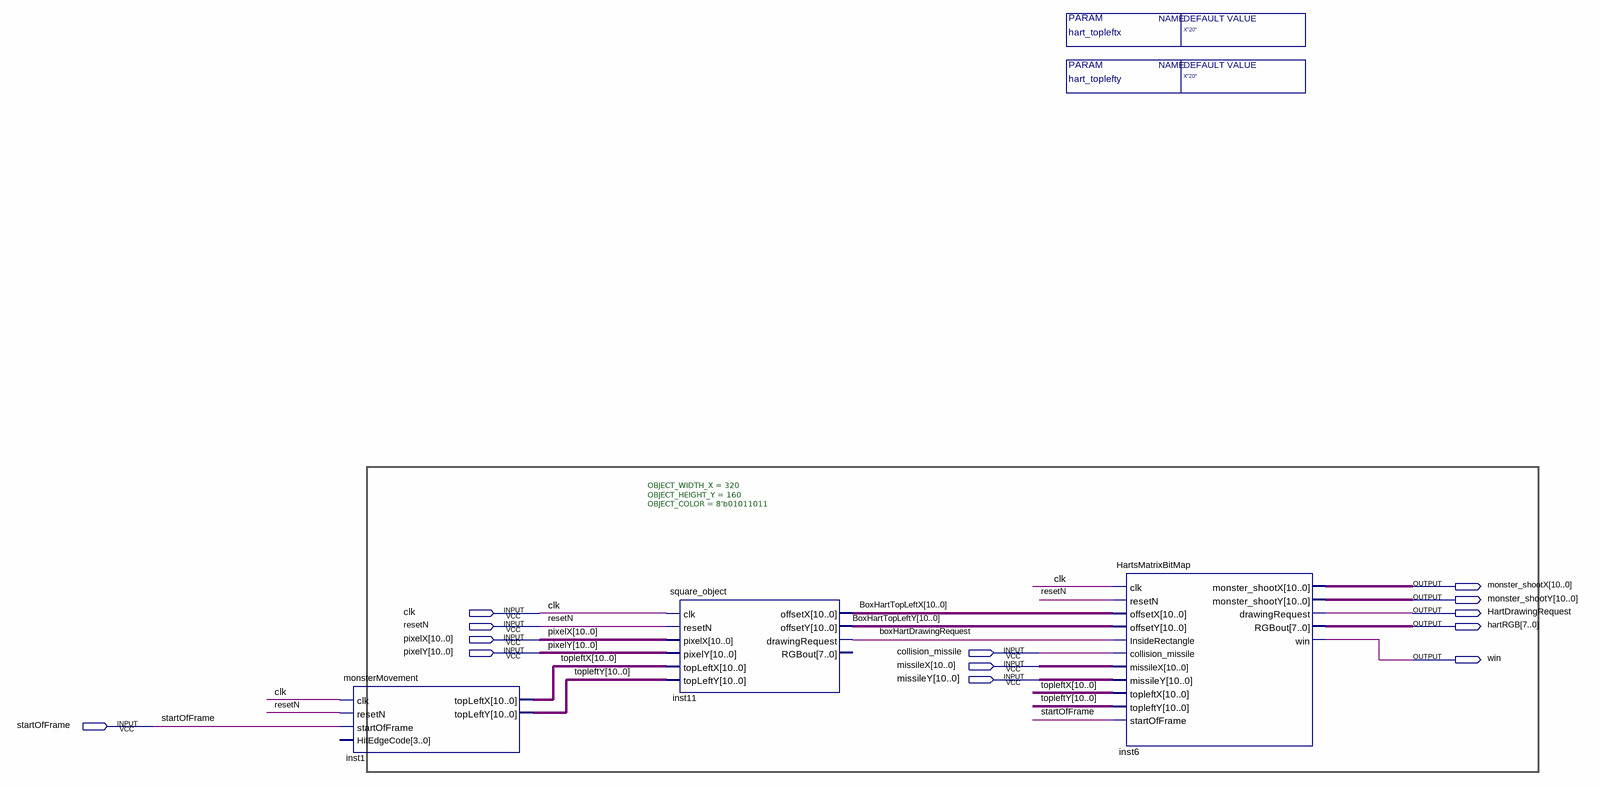
[diagram p0: schematic sheet]
// Quartus schematic HART_DISPLAY.bdf as structural Verilog: 3 symbols, 13 pins
module HART_DISPLAY #(parameter hart_topleftx = "X\"20\"", parameter hart_toplefty = "X\"20\"") (
  input  clk,
  input  resetN,
  input  [10:0] pixelX,
  input  [10:0] pixelY,
  input  collision_missile,
  input  [10:0] missileX,
  input  [10:0] missileY,
  input  startOfFrame,
  output [10:0] monster_shootX,
  output [10:0] monster_shootY,
  output HartDrawingRequest,
  output [7:0] hartRGB,
  output win
);

  wire boxHartDrawingRequest;
  wire [10:0] BoxHartTopLeftX, BoxHartTopLeftY, topleftX, topleftY;

  monsterMovement inst1 (
    .clk(clk), .resetN(resetN), .startOfFrame(startOfFrame), .topLeftX(topleftX), .topLeftY(topleftY));  // open: HitEdgeCode
  square_object #(.OBJECT_WIDTH_X(320), .OBJECT_HEIGHT_Y(160), .OBJECT_COLOR(8'b01011011)) inst11 (
    .clk(clk), .resetN(resetN), .pixelX(pixelX), .pixelY(pixelY), .topLeftX(topleftX), .topLeftY(topleftY),
    .offsetX(BoxHartTopLeftX), .offsetY(BoxHartTopLeftY), .drawingRequest(boxHartDrawingRequest));  // open: RGBout
  HartsMatrixBitMap inst6 (
    .clk(clk), .resetN(resetN), .offsetX(BoxHartTopLeftX), .offsetY(BoxHartTopLeftY),
    .InsideRectangle(boxHartDrawingRequest), .collision_missile(collision_missile), .missileX(missileX),
    .missileY(missileY), .topleftX(topleftX), .topleftY(topleftY), .startOfFrame(startOfFrame),
    .monster_shootX(monster_shootX), .monster_shootY(monster_shootY), .drawingRequest(HartDrawingRequest),
    .RGBout(hartRGB), .win(win));
endmodule
